# Altium schematic sheet _microsd.SchDoc
size Tabloid
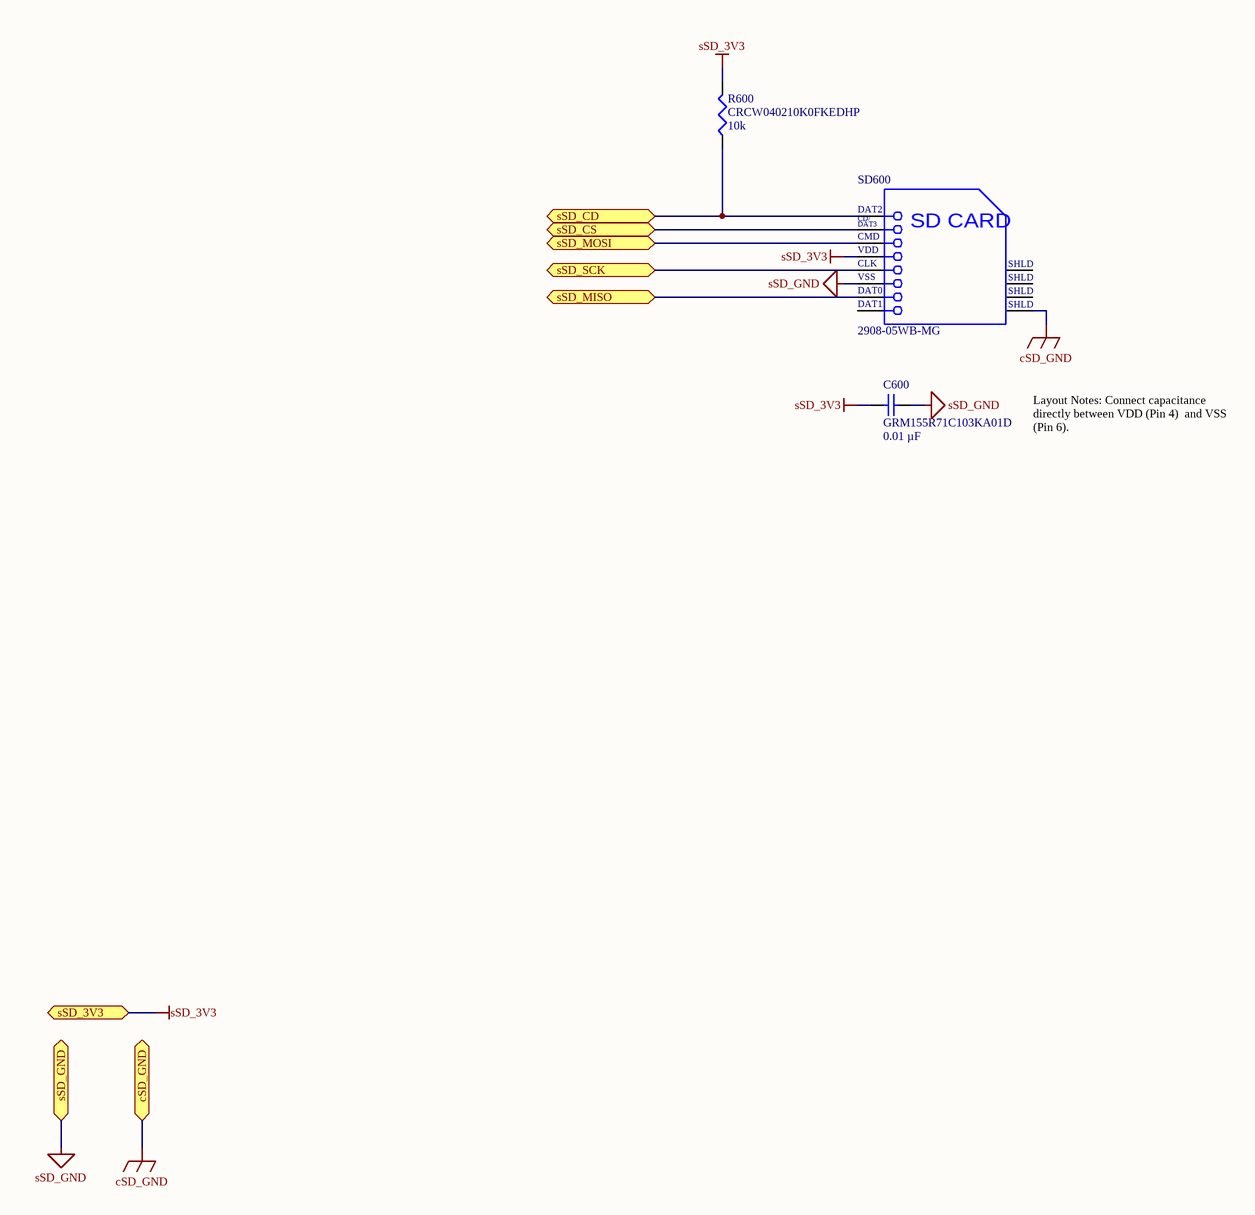
[diagram p0: _microsd.SchDoc]

## Parts
C600  GRM155R71C103KA01D  value 0.01 µF  [0402]
R600  CRCW040210K0FKEDHP  value 10k  [0402]
SD600  2908-05WB-MG  [3M-2908-05WB-MG_V]

## Ports
cSD_GND, sSD_3V3, sSD_CD, sSD_CS, sSD_GND, sSD_MISO, sSD_MOSI, sSD_SCK

## Nets
cSD_GND: SD600.12(SHLD) ; port cSD_GND
sSD_3V3: C600.2 R600.2 SD600.4(VDD) ; port sSD_3V3
sSD_GND: C600.1 SD600.6(VSS) ; port sSD_GND
sSD_CD: R600.1 SD600.1(DAT2) ; port sSD_CD
sSD_CS: SD600.2(CD/DAT3) ; port sSD_CS
sSD_MISO: SD600.7(DAT0) ; port sSD_MISO
sSD_MOSI: SD600.3(CMD) ; port sSD_MOSI
sSD_SCK: SD600.5(CLK) ; port sSD_SCK

Not connected (* = marked no-connect by the designer): SD600 8(DAT1) 9(SHLD) 10(SHLD) 11(SHLD)

## Notes on the sheet
- Layout Notes: Connect capacitance directly between VDD (Pin 4)  and VSS (Pin 6).
- (in symbol CMP-2000-05030-1) CD/; DAT3; SD CARD

## Library data of the parts
C600 = Cap: Cap, 0.01 µF, 16 V, X7R; Published: 8-Jun-2000; LatestRevisionDate: 17-Jul-2002; LatestRevisionNote: Re-released for DXP Platform.; PackageReference: RAD-0.3; Publisher: Altium Limited; PackageDescription: Radial Cap, Thru-Hole; 2 Leads; 0.3 in Pin Spacing
R600 = CRCW0402xxxxFKED: 0.125W, -55-155C, 1005, 50V, ±1%
SD600 = CMP-2000-05030-1: Card Connector Micro-SD, 500 VAC, 100 mOhm Min, 0.5 A, RoHS, Tape and Reel; Manufacturer: 3M; Connector Type: ConnectorandEjector; Other Related Documents: SDCardDateCodeDecipher; Insertion, Removal Method: PushIn,PushOut; Other Names: 3M5607CT; PCN Obsolescence/ EOL: 2908Series30/Jun/2010; Number of Positions: 10(8+2); Card Type: SecureDigital-microSD™; Online Catalog: 2900Series; Featured Product: 3MCardConnectormicroSD; Features: Switch; Packaging: CutTape(CT); Package Reference: 2908-05WB-MG; Package Description: 8-Pin Surface Mount Device, Body 15.2 x 14 mm, Pitch 1.1 mm; Contact Finish: Gold; Catalog Drawings: 2908-05WB-MG; Mounting Feature: Normal,Standard-Top; Series: 2900; Datasheet Version: Oct-06; Datasheet URL: http://datasheet.octopart.com/2908-05WB-MG-3M-datasheet-6398107.pdf; Contact Finish Thickness: 15µin(0.38µm); Manufacturer URL: http://www.3m.com/; Family: MemoryConnectors-PCCardSockets; Category: Connectors,Interconnects; Standard Package: 1; Mounting Type: SurfaceMount,RightAngle; Ejector Side: -